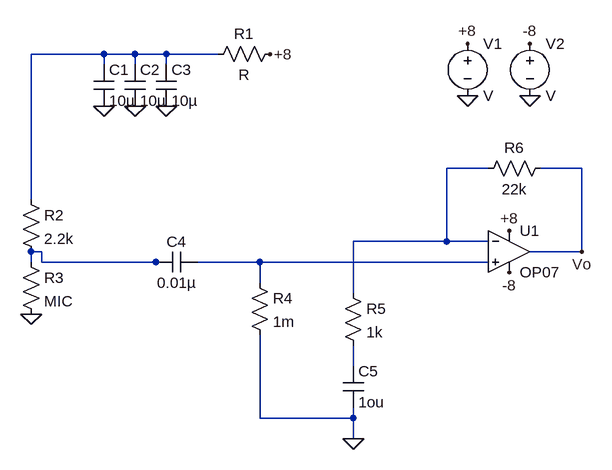
[diagram p0: schematic DSP_Final.asc]
DSP_Final.asc, the LTspice schematic file:
Version 4
SHEET 1 880 680
WIRE -464 -176 -576 -176
WIRE -416 -176 -464 -176
WIRE -368 -176 -416 -176
WIRE -288 -176 -368 -176
WIRE -464 -160 -464 -176
WIRE -416 -160 -416 -176
WIRE -368 -160 -368 -176
WIRE 128 0 64 0
WIRE 272 0 208 0
WIRE -576 48 -576 -176
WIRE 64 112 64 0
WIRE 64 112 -80 112
WIRE 128 112 64 112
WIRE -560 128 -576 128
WIRE 272 128 272 0
WIRE 272 128 192 128
WIRE -576 144 -576 128
WIRE -560 144 -560 128
WIRE -384 144 -560 144
WIRE -368 144 -384 144
WIRE -224 144 -320 144
WIRE 128 144 -224 144
WIRE -224 176 -224 144
WIRE -80 192 -80 112
WIRE -80 304 -80 272
WIRE -224 384 -224 256
WIRE -80 384 -80 368
WIRE -80 384 -224 384
WIRE -80 416 -80 384
FLAG 96 -112 0
FLAG 96 -192 +8
FLAG 192 -112 0
FLAG 192 -192 -8
FLAG 160 96 +8
FLAG 160 160 -8
FLAG -368 -96 0
FLAG -416 -96 0
FLAG -464 -96 0
FLAG -576 224 0
FLAG -80 416 0
FLAG -208 -176 +8
FLAG 272 128 Vo
SYMBOL OpAmps\\OP07 160 64 R0
SYMATTR InstName U1
SYMBOL voltage 96 -208 R0
SYMATTR InstName V1
SYMBOL voltage 192 -208 R0
SYMATTR InstName V2
SYMBOL cap -480 -160 R0
SYMATTR InstName C1
SYMATTR Value 10µ
SYMBOL cap -432 -160 R0
SYMATTR InstName C2
SYMATTR Value 10µ
SYMBOL cap -384 -160 R0
SYMATTR InstName C3
SYMATTR Value 10µ
SYMBOL res -192 -192 R90
WINDOW 0 0 56 VBottom 2
WINDOW 3 32 56 VTop 2
SYMATTR InstName R1
SYMBOL res -592 32 R0
SYMATTR InstName R2
SYMATTR Value 2.2k
SYMBOL res -592 128 R0
SYMATTR InstName R3
SYMATTR Value MIC
SYMBOL cap -320 128 R90
WINDOW 0 0 32 VBottom 2
WINDOW 3 32 32 VTop 2
SYMATTR InstName C4
SYMATTR Value 0.01µ
SYMBOL res 224 -16 R90
WINDOW 0 0 56 VBottom 2
WINDOW 3 32 56 VTop 2
SYMATTR InstName R6
SYMATTR Value 22k
SYMBOL res -240 160 R0
SYMATTR InstName R4
SYMATTR Value 1m
SYMBOL res -96 176 R0
SYMATTR InstName R5
SYMATTR Value 1k
SYMBOL cap -96 304 R0
SYMATTR InstName C5
SYMATTR Value 1ou

The netlist it stands for:
* DSP_Final.asc
XU1 N004 N002 +8 -8 Vo LT1001  ; OP07, pins In+ In- V+ V- OUT
V1 +8 0 V
V2 -8 0 V
C1 N001 0 10µ
C2 N001 0 10µ
C3 N001 0 10µ
R1 +8 N001 R
R2 N001 N003 2.2k
R3 N003 0 MIC
C4 N004 N003 0.01µ
R6 Vo N002 22k
R4 N004 0 1m
R5 N002 N005 1k
C5 N005 0 1ou
.lib LTC.lib
.backanno
.end